# EAGLE design ignition6 (EAGLE 6.4)
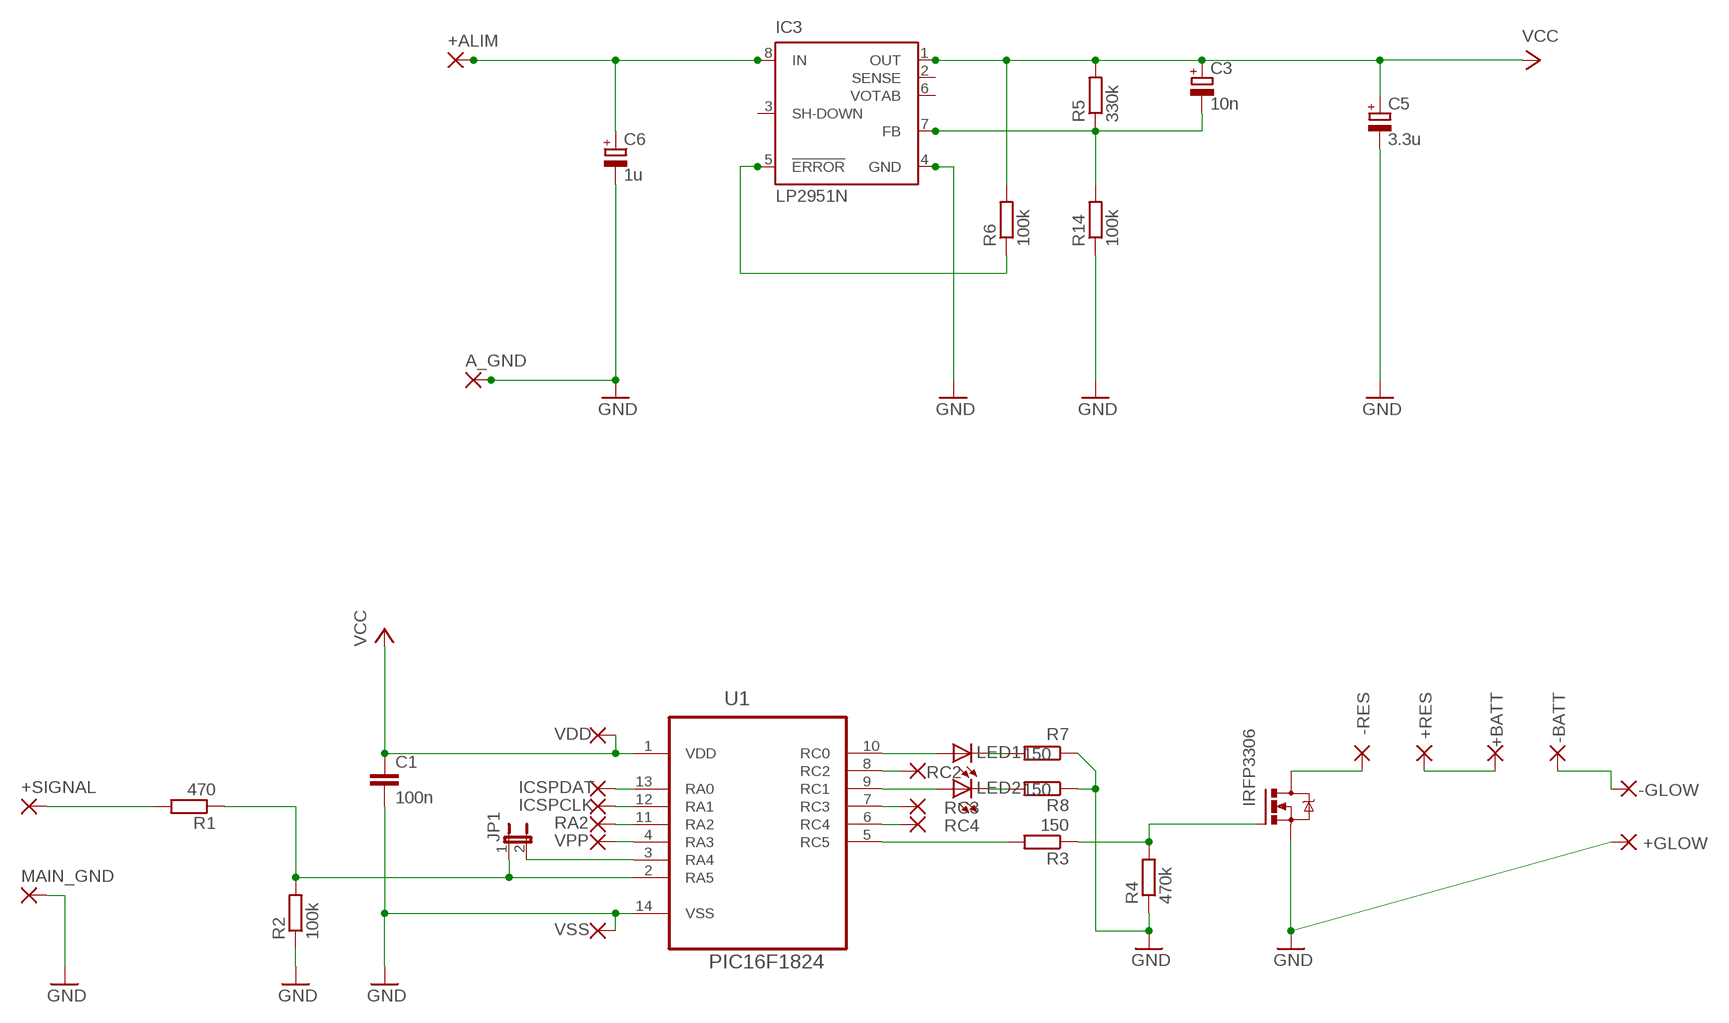
[diagram p0: schematic, sheet 1]

## Parts
+ALIM  2,15/1,0  [2,15/1,0]
+BATT  WIREPAD3,17/1,3  [3,17/1,3]
+GLOW  WIREPAD3,17/1,3  [3,17/1,3]
+RES  WIREPAD3,17/1,3  [3,17/1,3]
+SIGNAL  2,15/1,0  [2,15/1,0]
-BATT  WIREPAD3,17/1,3  [3,17/1,3]
-GLOW  WIREPAD3,17/1,3  [3,17/1,3]
-RES  WIREPAD3,17/1,3  [3,17/1,3]
A_GND  2,15/1,0  [2,15/1,0]
C1  100n  C-EU050-035X075  [C050-035X075]
C3  10n  CPOL-EUE5-6  [E5-6]
C5  3.3u  CPOL-EUE2.5-5  [E2,5-5]
C6  1u  CPOL-EUE2.5-5  [E2,5-5]
IC3  LP2951N  [DIL08]
ICSPCLK  2,15/1,0  [2,15/1,0]
ICSPDAT  2,15/1,0  [2,15/1,0]
JP1  JP1E  [JP1]
LED1  LED3MM  [LED3MM]
LED2  LED3MM  [LED3MM]
MAIN_GND  2,15/1,0  [2,15/1,0]
Q2  IRFP3306  IRFPC40  [TO247BV]
R1  470  R-EU_0207/7  [0207/7]
R2  100k  R-EU_0207/7  [0207/7]
R3  150  R-EU_0207/7  [0207/7]
R4  470k  R-EU_0207/7  [0207/7]
R5  330k  R-EU_0207/7  [0207/7]
R6  100k  R-EU_0207/7  [0207/7]
R7  150  R-EU_0207/7  [0207/7]
R8  150  R-EU_0207/7  [0207/7]
R14  100k  R-EU_0207/7  [0207/7]
RA2  2,15/1,0  [2,15/1,0]
RC2  2,15/1,0  [2,15/1,0]
RC3  2,15/1,0  [2,15/1,0]
RC4  2,15/1,0  [2,15/1,0]
U1  PIC16F1824  PIC16F1824-I/P  [DIP254P762X533-14]
VDD  WIREPAD2,15/1,0  [2,15/1,0]
VPP  2,15/1,0  [2,15/1,0]
VSS  WIREPAD2,15/1,0  [2,15/1,0]

## Nets
GND: +GLOW.1(P) A_GND.1(P) C1.2 C5.- C6.- IC3.4(GND) MAIN_GND.1(P) Q2.S R2.1 R4.1 R7.1 R8.1 R14.1 U1.14(VSS) VSS.1(P)
N$1: +SIGNAL.1(P) R1.2
N$2: JP1.1 R1.1 R2.2 U1.2(RA5)
N$3: R3.2 U1.5(RC5)
N$4: RC2.1(P) U1.8(RC2)
N$5: +ALIM.1(P) C6.+ IC3.8(IN)
N$6: Q2.G R3.1 R4.2
N$7: -RES.1(P) Q2.D
N$8: IC3.5(!ERROR) R6.1
N$9: JP1.2 U1.3(RA4)
N$10: +BATT.1(P) +RES.1(P)
N$11: -BATT.1(P) -GLOW.1(P)
N$12: U1.4(RA3) VPP.1(P)
N$13: C3.- IC3.7(FB) R5.1 R14.2
N$14: ICSPCLK.1(P) U1.12(RA1)
N$15: ICSPDAT.1(P) U1.13(RA0)
N$16: LED1.A U1.10(RC0)
N$17: LED2.A U1.9(RC1)
N$18: LED1.K(C) R7.2
N$19: RC3.1(P) U1.7(RC3)
N$20: RC4.1(P) U1.6(RC4)
N$21: RA2.1(P) U1.11(RA2)
N$22: LED2.K(C) R8.2
VCC: C1.1 C3.+ C5.+ IC3.1(OUT) R5.2 R6.2 U1.1(VDD) VDD.1(P)
Unconnected: IC3.2(SENSE) IC3.3(SH-DOWN) IC3.6(VOTAB)

## Library data of the parts
+ALIM +SIGNAL A_GND ICSPCLK ICSPDAT MAIN_GND RA2 RC2-RC4 VPP = wirepad:2,15/1,0: THROUGH-HOLE PAD
+BATT +GLOW +RES -BATT -GLOW -RES VDD VSS = wirepad:WIREPAD: Wire PAD connect wire on PCB
C1 = rcl:C-EU: CAPACITOR, European symbol
C3 C5 C6 = rcl:CPOL-EU: POLARIZED CAPACITOR, European symbol
IC3 = linear:LP2951: 100 mA, Low Power Low Dropout Voltage Regulator Source: http://www.onsemi.com/pub/Collateral/LP2950-D.PDF
JP1 = jumper:JP1E: JUMPER
LED1 LED2 = adafruit:LED: LED OSRAM: - CHIPLED LG R971, LG N971, LY N971, LG Q971, LY Q971, LO R971, LY R971 LH N974, LH R974 LS Q976, LO Q976, LY Q976 LO Q996 - Hyper CHIPLED LW Q18S LB Q993, LB Q99A, LB R99A - SideLED LS A670, LO A670, LY A670, LG A670, LP A670 LB A673, LV A673, LT A673, LW A673 LH A674 LY A675 LS A676, LA A676, LO A676, LY A676, LW A676 LS A679, LY A679, LG A679 - Hyper Micro SIDELED® LS Y876, LA Y876, LO Y876, LY Y876 LT Y87S - SmartLED LW L88C, LW L88S LB L89C, LB L89S, LG L890 LS L89K, LO L89K, LY L89K LS L896, LA L896, LO L896, LY L896 - TOPLED LS T670, LO T670, LY T670, LG T670, LP T670 LSG T670, LSP T670, LSY T670, LOP T670, LYG T670 LG T671, LOG T671, LSG T671 LB T673, LV T673, LT T673, LW T673 LH T674 LS T676, LA T676, LO T676, LY T676, LB T676, LH T676, LSB T676, LW T676 LB T67C, LV T67C, LT T67C, LS T67K, LO T67K, LY T67K, LW E67C LS E67B, LA E67B, LO E67B, LY E67B, LB E67C, LV E67C, LT E67C LW T67C LS T679, LY T679, LG T679 LS T770, LO T770, LY T770, LG T770, LP T770 LB T773, LV T773, LT T773, LW T773 LH T774 LS E675, LA E675, LY E675, LS T675 LS T776, LA T776, LO T776, LY T776, LB T776 LHGB T686 LT T68C, LB T68C - Hyper Mini TOPLED® LB M676 - Mini TOPLED Santana® LG M470 LS M47K, LO M47K, LY M47K Source: http://www.osram.convergy.de/
Q2 = transistor-power:IRFPC40: N-CHANNEL MOS FET
R1-R8 R14 = rcl:R-EU_: RESISTOR, European symbol
U1 = 16f1824dip:PIC16F1824-I/P: IC PIC MCU 8BIT 14KB FLSH,DIP-14; MPN: PIC16F1824-I/P; OC_FARNELL: 1814944; OC_NEWARK: 65R5964; PACKAGE: DIP-14; SUPPLIER: Microchip

## Net classes
0 default: width 1.27 mm, drill 0.508 mm, clearance 0.635 mm
1 power: width 2.54 mm, drill 0.508 mm, clearance 0.635 mm
2 bottom: clearance 1.27 mm

## Board
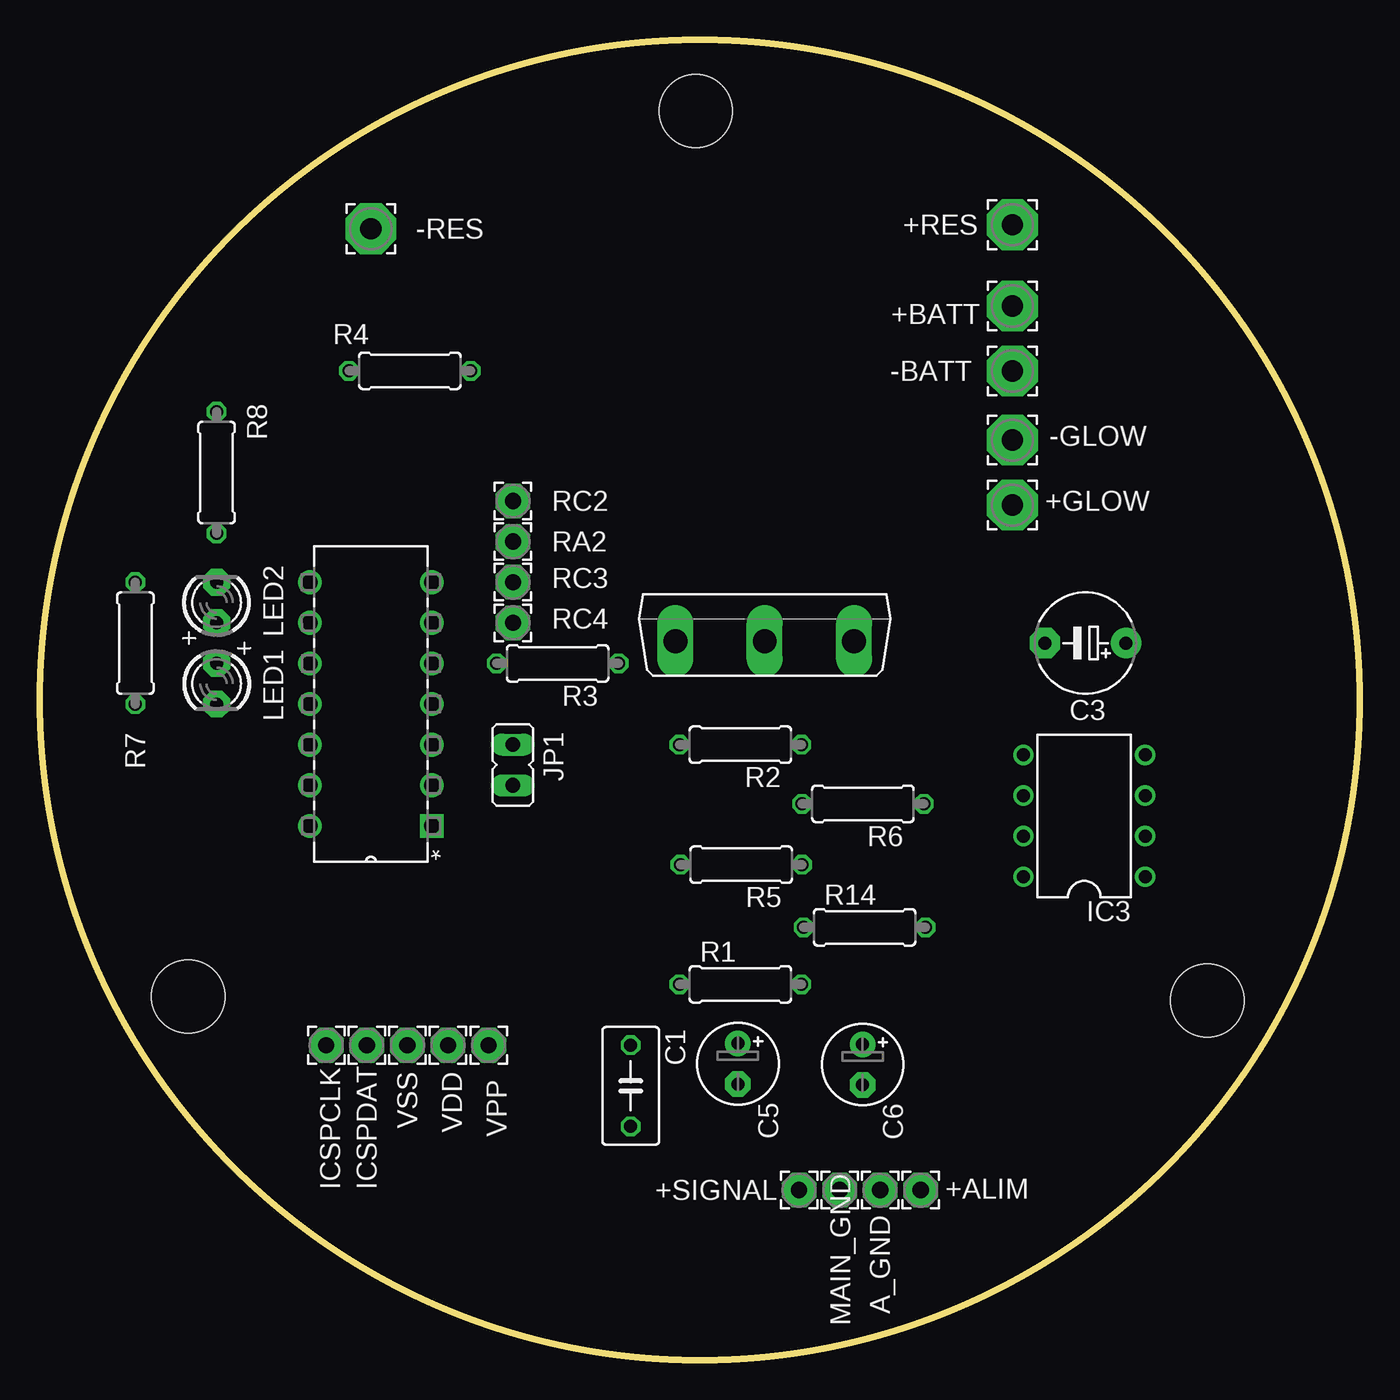
[diagram p1: board, top side]
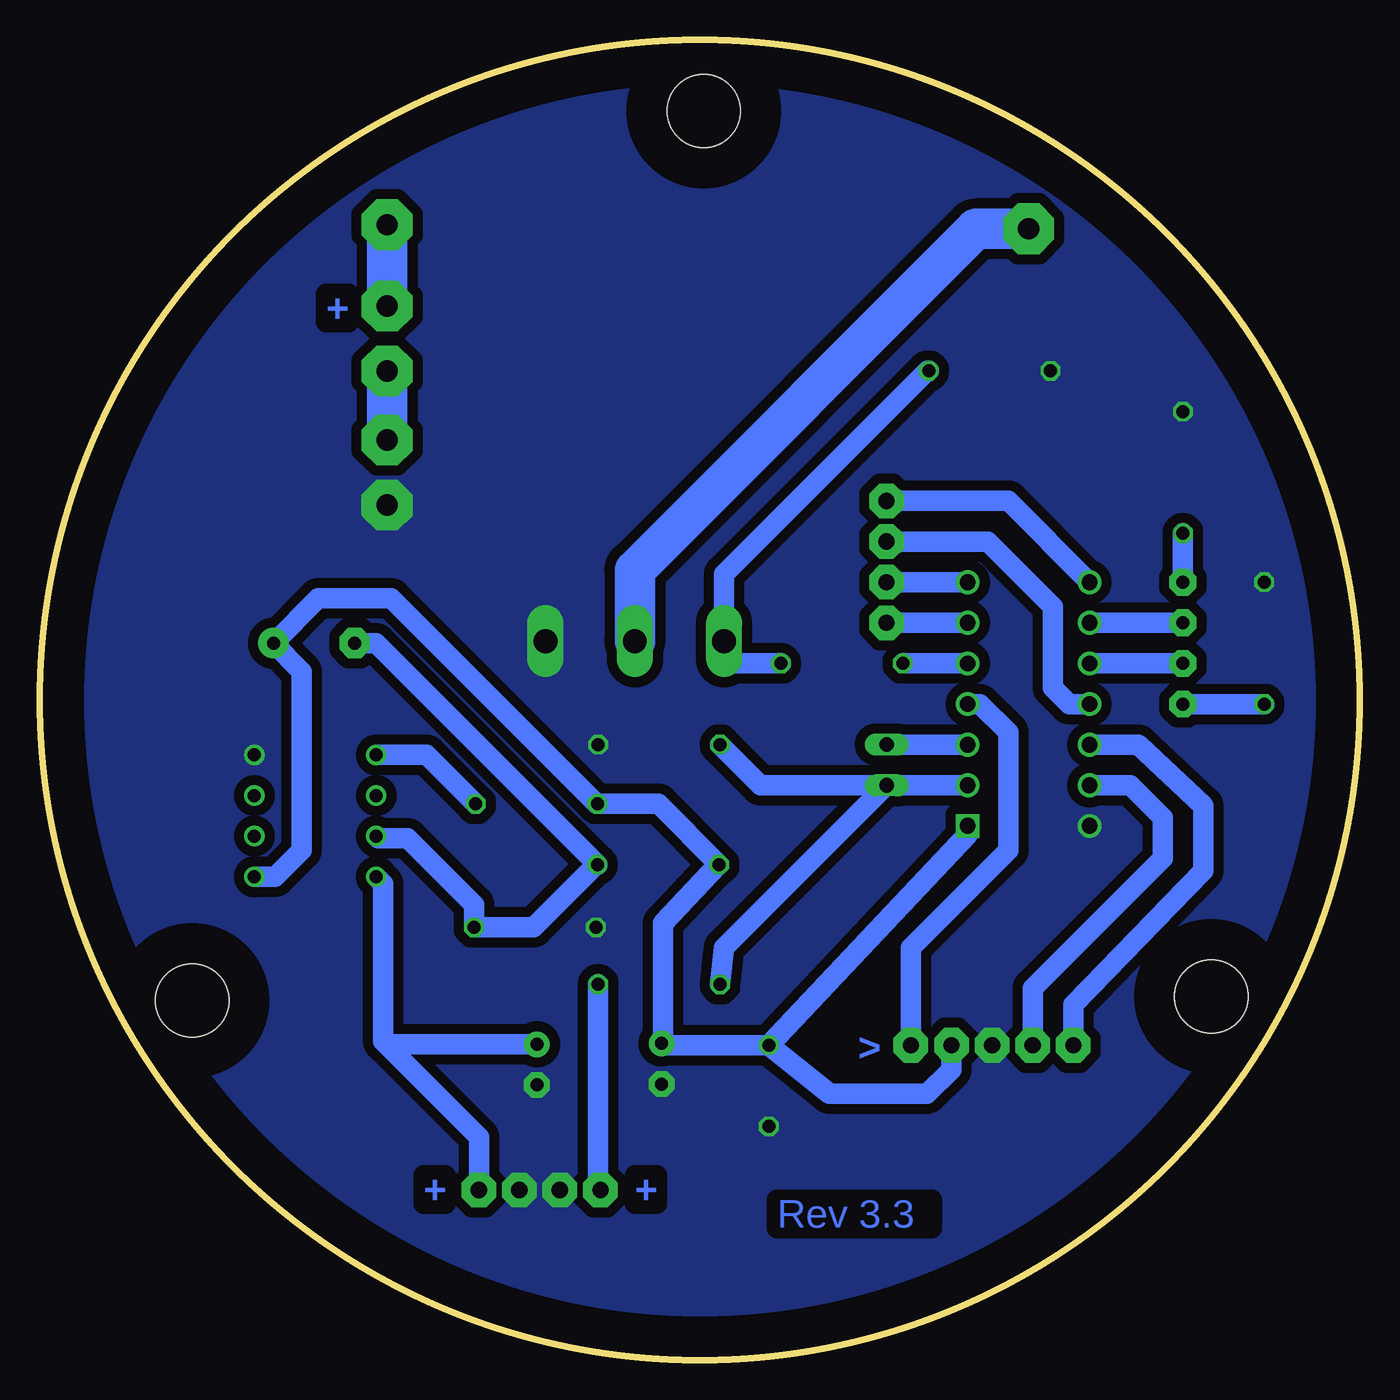
[diagram p2: board, bottom side, seen from below]

Size 82.55 x 82.55 mm. Coordinates in mm from the lower left corner, seen from the top.
Outline: circle at 41.27,41.27 radius 41.27
Copper layers (1*2*15*16): Top 0.035mm / dielectric 0.2mm / Route2 0.0175mm / dielectric 1.1mm / Route15 0.0175mm / dielectric 0.2mm / Bottom 0.035mm
Design rules "SeeedStudio_DRU_no_angle_20130527 *": minimum track width 6mil, minimum drill 12mil, track to track 6mil, track to pad 6mil, pad to pad 6mil, via to via 6mil, smd to smd 0mil, copper to edge 100mil, drill to drill 10mil, minimum pad ring 6mil, minimum via ring 6mil, stop-mask expansion 2mil, vias tented up to drill 25mil, thermal gap 10mil
Holes 4.57 mm at 41.02,78.11 9.27,22.73 73.03,22.48

### Footprints (pad centres in the part's own frame; a part is rotated, then mirrored left to right if it is on the bottom)
2,15/1,0 = drill 1.016 pad 2.159 octagon: 1 0,0
3,17/1,3 = drill 1.321 pad 3.175 octagon: 1 0,0
C050-035X075 = drill 0.813 octagon: 1 -2.54,0; 2 2.54,0
E5-6 = drill 0.813 pad 1.905: + -2.54,0 | drill 0.813 pad 1.905 octagon: - 2.54,0
E2,5-5 = drill 0.813 pad 1.6: + -1.27,0 | drill 0.813 pad 1.6 octagon: - 1.27,0
DIL08 = drill 0.813 pad 1.27: 1 -3.81,-3.81; 2 -1.27,-3.81; 3 1.27,-3.81; 4 3.81,-3.81; 5 3.81,3.81; 6 1.27,3.81; 7 -1.27,3.81; 8 -3.81,3.81
JP1 = drill 0.914 long: 1 0,-1.27; 2 0,1.27
LED3MM = drill 0.813 pad 1.676 octagon: A -1.27,0; K 1.27,0
TO247BV = drill 1.499 long: D 0,-2.921; G -5.588,-2.921; S 5.588,-2.921
0207/7 = drill 0.813 octagon: 1 -3.81,0; 2 3.81,0
DIP254P762X533-14 = drill 0.991 square: 1 -7.62,15.24 | drill 0.991: 2 -7.62,12.7; 3 -7.62,10.16; 4 -7.62,7.62; 5 -7.62,5.08; 6 -7.62,2.54; 7 -7.62,0; 8 0,0; 9 0,2.54; 10 0,5.08; 11 0,7.62; 12 0,10.16; 13 0,12.7; 14 0,15.24

### Placement (x,y rotation side)
+ALIM  55.09,10.63 0 top
+BATT  60.83,65.91 0 top
+GLOW  60.83,53.47 0 top
+RES  60.83,70.99 0 top
+SIGNAL  47.49,10.63 0 top
-BATT  60.83,61.85 0 top
-GLOW  60.83,57.53 0 top
-RES  20.7,70.74 0 top
A_GND  52.56,10.63 90 top
C1  36.96,17.14 270 top
C3  65.41,44.83 180 top
C5  43.66,18.52 270 top
C6  51.46,18.47 270 top
IC3  65.32,34.03 90 top
ICSPCLK  17.91,19.68 0 top
ICSPDAT  20.45,19.68 0 top
JP1  29.59,37.21 0 top
LED1  11.05,42.29 270 top
LED2  11.05,47.37 90 top
MAIN_GND  50.03,10.63 0 top
Q2  45.34,47.88 0 top
R1  43.81,23.49 0 top
R2  43.81,38.48 180 top
R3  32.38,43.56 180 top
R4  23.14,61.86 0 top
R5  43.87,30.98 180 top
R6  51.48,34.78 180 top
R7  5.97,44.83 270 top
R8  11.05,55.5 270 top
R14  51.58,27.06 0 top
RA2  29.59,51.18 0 top
RC2  29.59,53.72 0 top
RC3  29.59,48.64 0 top
RC4  29.59,46.1 0 top
U1  16.89,48.64 180 top
VDD  25.53,19.68 0 top
VPP  28.07,19.68 0 top
VSS  22.99,19.68 0 top

### Tracks (layer width: path | path; a pad name or v marks a point on that pad's centre or on a via)
GND
  pour Bottom (no thermals): -4.45,83.19 83.44,83.19 83.44,-0.64 -4.45,-0.64
N$1
  Bottom 1.27: R1.2 47.62,10.76 +SIGNAL.1
N$2
  Bottom 1.27: JP1.1 37.46,35.94 R2.2 | U1.2 JP1.1 | JP1.1 39.75,25.78 R1.1
N$3
  Bottom 1.27: U1.5 R3.2
N$4
  Bottom 1.27: U1.8 21.97,53.72 RC2.1
N$5
  Bottom 1.27: +ALIM.1 55.09,13.94 60.89,19.74 | IC3.8 61.09,29.79 61.09,19.94 60.89,19.74 | C6.+ 60.89,19.74
N$6
  Bottom 1.27: R3.1 39.75,43.56 Q2.G 39.75,49.15 27.04,61.86 R4.2
N$7
  Bottom 2.54: -RES.1 24,70.74 45.34,49.4 Q2.D
N$8
  Bottom 1.27: IC3.5 58.35,37.84 R6.1
N$9
  Bottom 1.27: U1.3 JP1.2
N$10
  Bottom 2.54: +RES.1 +BATT.1
N$11
  Bottom 2.54: -BATT.1 -GLOW.1
N$12
  Bottom 1.27: VPP.1 28.07,25.78 21.97,31.88 21.97,39.24 23.75,41.02 U1.4
N$13
  Bottom 1.27: C3.- 61.53,44.83 R5.1 47.88,30.86 51.68,27.06 R14.2 55.39,28.47 59.56,32.64 61.39,32.64 IC3.7
N$14
  Bottom 1.27: ICSPCLK.1 17.91,22.22 9.78,30.61 9.78,34.67 13.84,38.48 U1.12
N$15
  Bottom 1.27: ICSPDAT.1 20.45,23.24 12.32,31.37 12.32,33.91 14.35,35.94 U1.13
N$16
  Bottom 1.27: U1.10 LED1.A
N$17
  Bottom 1.27: U1.9 LED2.A
N$18
  Bottom 1.27: LED1.K R7.2
N$19
  Bottom 1.27: U1.7 RC3.1
N$20
  Bottom 1.27: U1.6 RC4.1
N$21
  Bottom 1.27: U1.11 18.16,41.02 19.18,42.04 19.18,47.12 23.24,51.18 RA2.1
N$22
  Bottom 1.27: LED2.K R8.2
VCC
  Bottom 1.27: IC3.1 67.82,30.22 66.17,31.88 66.17,43.05 C3.+ 65.15,47.62 60.58,47.62 47.73,34.78 R6.2 43.86,34.78 R5.2 40.14,30.98 43.56,27.3 43.56,19.9 C5.+ 43.55,19.68 C1.1 | U1.1 24.51,32.89 C1.1 | VDD.1 25.53,18.16 27.05,16.64 33.15,16.64 C1.1

### Text on the board
Bottom: + | > | + | + | Rev 3.3